# Altium project Smart_Switch_PCB.PrjPcb
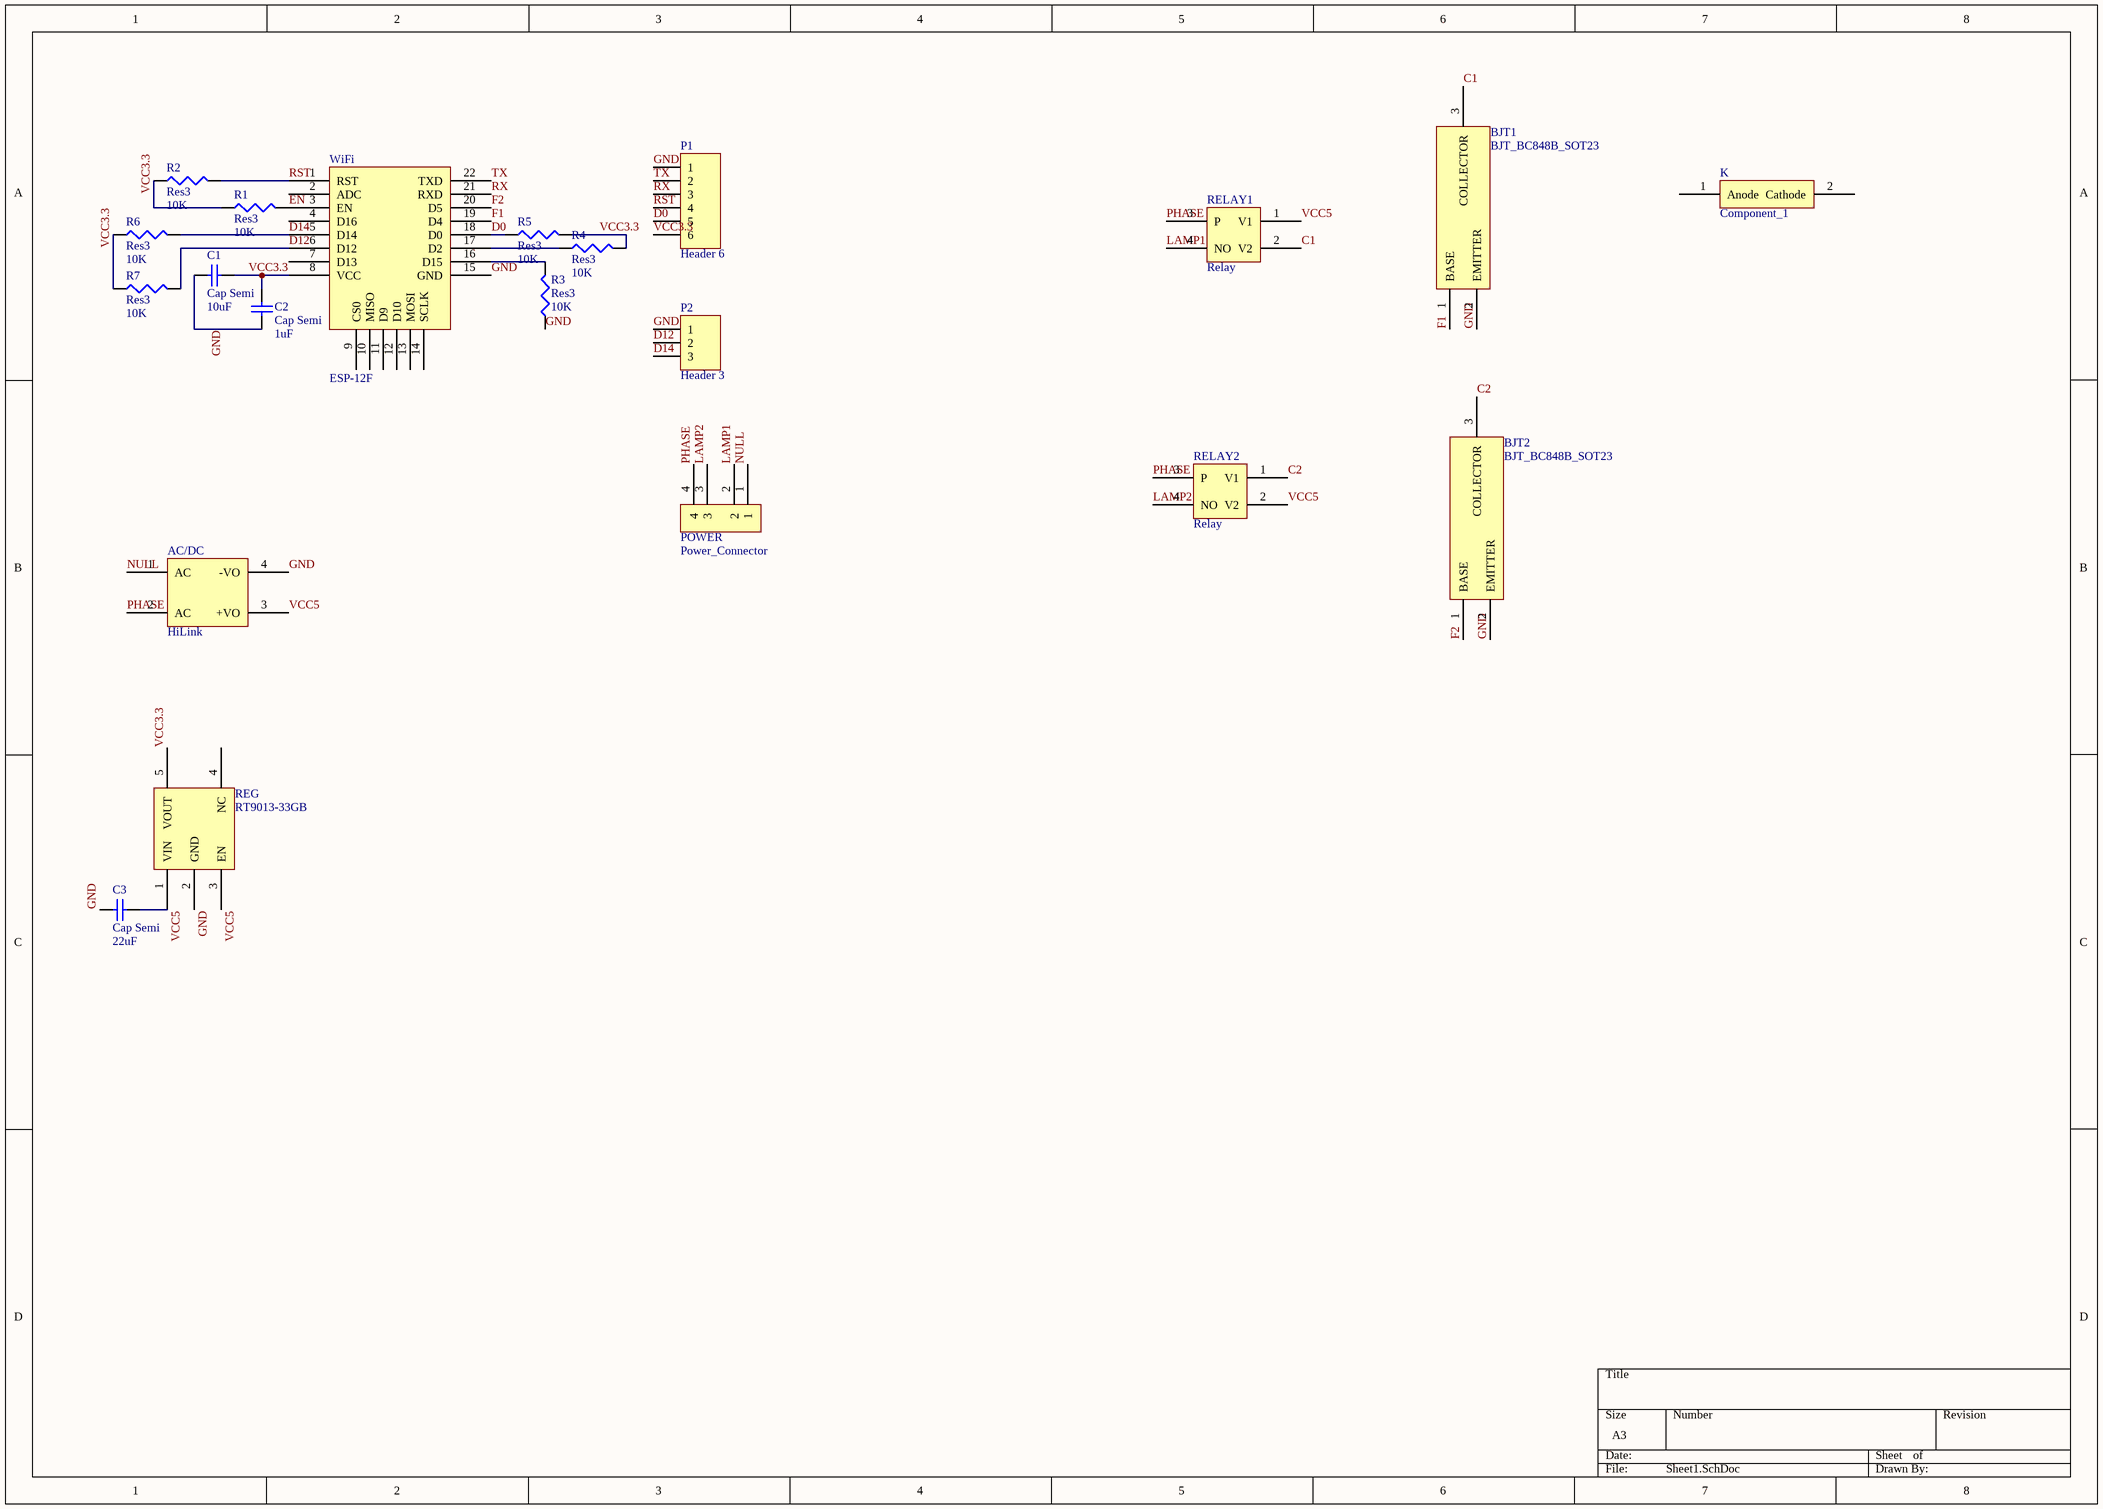
[diagram p0: Sheet1.SchDoc]
1 sheet, 21 parts. Net scope: global (net labels, ports and power ports of the same name join across sheets).
Board file: PCB1.PcbDoc

## Sheet Sheet1.SchDoc
size A3

### Parts
AC/DC  HiLink  [HiLink]
BJT1  BJT_BC848B_SOT23  [BJT_BC848B_SOT23]
BJT2  BJT_BC848B_SOT23  [BJT_BC848B_SOT23]
C1  Cap Semi  value 10uF  [C1206]
C2  Cap Semi  value 1uF  [C1206]
C3  Cap Semi  value 22uF  [C1206]
K  Component_1  [PCBComponent_1]
P1  Header 6  [HDR1X6]
P2  Header 3  [HDR1X3]
POWER  Power_Connector  [Power_Connector]
R1  Res3  value 10K  [J1-0603]
R2  Res3  value 10K  [J1-0603]
R3  Res3  value 10K  [J1-0603]
R4  Res3  value 10K  [J1-0603]
R5  Res3  value 10K  [J1-0603]
R6  Res3  value 10K  [J1-0603]
R7  Res3  value 10K  [J1-0603]
REG  RT9013-33GB  [RT9013-33GB]
RELAY1  Relay  [Relay]
RELAY2  Relay  [Relay]
WiFi  ESP-12F  [ESP-12F]

### Nets
C1: BJT1.3(COLLECTOR) RELAY1.2(V2)
C2: BJT2.3(COLLECTOR) RELAY2.1(V1)
D0: P1.5 R5.1 WiFi.18(D0)
D12: P2.2 R7.2 WiFi.6(D12)
D14: P2.3 R6.2 WiFi.5(D14)
EN: R1.2 WiFi.3(EN)
F1: BJT1.1(BASE) WiFi.19(D4)
F2: BJT2.1(BASE) WiFi.20(D5)
GND: AC/DC.4(-VO) BJT1.2(EMITTER) BJT2.2(EMITTER) C1.1 C2.1 C3.2 P1.1 P2.1 R3.1 REG.2(GND) WiFi.15(GND)
LAMP1: POWER.2 RELAY1.4(NO)
LAMP2: POWER.3 RELAY2.4(NO)
NULL: AC/DC.1(AC) POWER.1
PHASE: AC/DC.2(AC) POWER.4 RELAY1.3(P) RELAY2.3(P)
RST: P1.4 R2.2 WiFi.1(RST)
RX: P1.3 WiFi.21(RXD)
TX: P1.2 WiFi.22(TXD)
VCC3.3: C1.2 C2.2 P1.6 R1.1 R2.1 R4.2 R5.2 R6.1 R7.1 REG.5(VOUT) WiFi.8(VCC)
VCC5: AC/DC.3(+VO) C3.1 REG.1(VIN) REG.3(EN) RELAY1.1(V1) RELAY2.2(V2)
NetR3_2: R3.2 WiFi.16(D15)
NetR4_1: R4.1 WiFi.17(D2)

Not connected (* = marked no-connect by the designer): K 1(Anode) 2(Cathode); REG 4(NC); WiFi 2(ADC) 4(D16) 7(D13) 9(CS0) 10(MISO) 11(D9) 12(D10) 13(MOSI) 14(SCLK)

### Library data of the parts
C1-C3 = Cap Semi: Capacitor (Semiconductor SIM Model); Published: 8-Jun-2000; LatestRevisionDate: 29-May-2009; LatestRevisionNote: IPC-7351 Footprint Added.; PackageReference: C1206; Publisher: Altium Limited; PackageDescription: Chip Capacitor
P1 = Header 6: Header, 6-Pin; LatestRevisionDate: 17-Jul-2002; LatestRevisionNote: Re-released for DXP Platform.; Publisher: Altium Limited
P2 = Header 3: Header, 3-Pin; LatestRevisionDate: 17-Jul-2002; LatestRevisionNote: Re-released for DXP Platform.; Publisher: Altium Limited
R1-R7 = Res3: Resistor; Published: 8-Jun-2000; LatestRevisionDate: 29-May-2009; LatestRevisionNote: IPC-7351 Footprint Added.; PackageReference: J1-0603; Publisher: Altium Limited; PackageDescription: Chip Resistor